# Altium project syspcb.PrjPCB
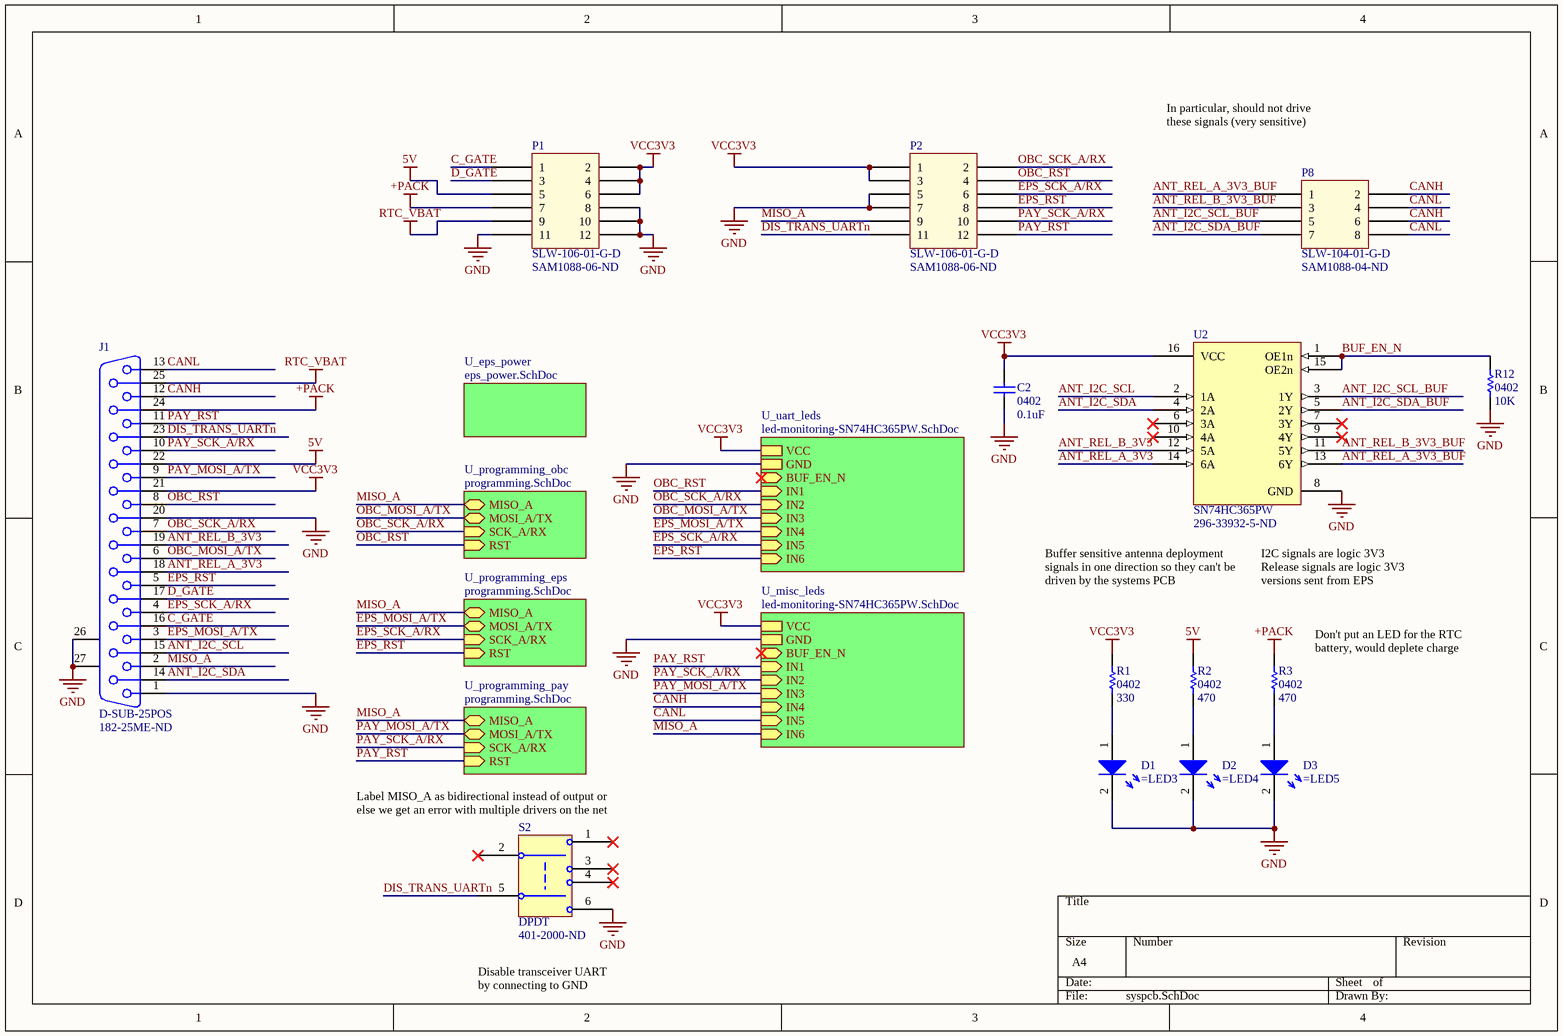
[diagram p0: syspcb.SchDoc]
3 sheets, 37 parts. Net scope: hierarchical (ports join the sheet entries above them; power ports are global).
Board file: syspcb.PcbDoc
Sheets:
  syspcb.SchDoc
    U_eps_power = eps_power.SchDoc
    U_programming_obc = programming.SchDoc
    U_programming_eps = programming.SchDoc
    U_programming_pay = programming.SchDoc

## Sheet syspcb.SchDoc
size A4

### Parts
C2  0402  value 0.1uF  [CAP0402R]
D1  (no value)  [LED0603]
D2  (no value)  [LED0603]
D3  (no value)  [LED0603]
J1  D-SUB-25POS  Supplier Part Number 1: 182-25ME-ND  [D-SUB-25POS]
P1  SLW-106-01-G-D  Supplier Part Number 1: SAM1088-06-ND  [SLW-106-01-X-D]
P2  SLW-106-01-G-D  Supplier Part Number 1: SAM1088-06-ND  [SLW-106-01-X-D]
P8  SLW-104-01-G-D  Supplier Part Number 1: SAM1088-04-ND  [SLW-104-01-X-D]
R1  0402  value 330  [RES0402R]
R2  0402  value 470  [RES0402R]
R3  0402  value 470  [RES0402R]
R12  0402  value 10K  [RES0402R]
S2  DPDT  Supplier Part Number 1: 401-2000-ND  [JS202011AQN - Slide Switch]
U2  SN74HC365PW  Supplier Part Number 1: 296-33932-5-ND  [SOP65P640X120-16N]

### Sub-sheets
U_eps_power = eps_power.SchDoc: no entries
U_misc_leds = led-monitoring-SN74HC365PW.SchDoc (file not in this document): VCC, GND, BUF_EN_N (in), IN1 (in), IN2 (in), IN3 (in), IN4 (in), IN5 (in), IN6 (in)
U_programming_eps = programming.SchDoc: MISO_A (bidir), MOSI_A/TX (bidir), SCK_A/RX (in), RST (in)
U_programming_obc = programming.SchDoc: MISO_A (bidir), MOSI_A/TX (bidir), SCK_A/RX (in), RST (in)
U_programming_pay = programming.SchDoc: MISO_A (bidir), MOSI_A/TX (bidir), SCK_A/RX (in), RST (in)
U_uart_leds = led-monitoring-SN74HC365PW.SchDoc (file not in this document): VCC, GND, BUF_EN_N (in), IN1 (in), IN2 (in), IN3 (in), IN4 (in), IN5 (in), IN6 (in)

### Nets
5V: J1.22 P1.5 R2.2
+PACK: J1.24 P1.7 R3.2
GND: C2.1 D1.2 D2.2 D3.2 J1.1 J1.20 J1.26(MH1) J1.27(MH2) P1.8 P1.10 P1.11 P1.12 P2.5 P2.7 R12.1 S2.6(POLE2B) U2.8(GND) ; sheet U_uart_leds/GND, sheet U_misc_leds/GND
RTC_VBAT: J1.25 P1.9
VCC3V3: C2.2 J1.21 P1.2 P1.4 P1.6 P2.1 P2.3 R1.2 U2.16(VCC) ; sheet U_uart_leds/VCC, sheet U_misc_leds/VCC
ANT_I2C_SCL: J1.15 U2.2(1A)
ANT_I2C_SCL_BUF: P8.5 U2.3(1Y)
ANT_I2C_SDA: J1.14 U2.4(2A)
ANT_I2C_SDA_BUF: P8.7 U2.5(2Y)
ANT_REL_A_3V3: J1.18 U2.14(6A)
ANT_REL_A_3V3_BUF: P8.1 U2.13(6Y)
ANT_REL_B_3V3: J1.19 U2.12(5A)
ANT_REL_B_3V3_BUF: P8.3 U2.11(5Y)
BUF_EN_N: R12.2 U2.1(OE1n) U2.15(OE2n)
C_GATE: J1.16 P1.1
CANH: J1.12 P8.2 P8.6 ; sheet U_misc_leds/IN4
CANL: J1.13 P8.4 P8.8 ; sheet U_misc_leds/IN5
D_GATE: J1.17 P1.3
DIS_TRANS_UARTn: J1.23 P2.11 S2.5(POLE2)
EPS_MOSI_A/TX: J1.3 ; sheet U_programming_eps/MOSI_A/TX, sheet U_uart_leds/IN4
EPS_RST: J1.5 P2.8 ; sheet U_programming_eps/RST, sheet U_uart_leds/IN6
EPS_SCK_A/RX: J1.4 P2.6 ; sheet U_programming_eps/SCK_A/RX, sheet U_uart_leds/IN5
MISO_A: J1.2 P2.9 ; sheet U_programming_obc/MISO_A, sheet U_programming_eps/MISO_A, sheet U_programming_pay/MISO_A, sheet U_misc_leds/IN6
OBC_MOSI_A/TX: J1.6 ; sheet U_programming_obc/MOSI_A/TX, sheet U_uart_leds/IN3
OBC_RST: J1.8 P2.4 ; sheet U_programming_obc/RST, sheet U_uart_leds/IN1
OBC_SCK_A/RX: J1.7 P2.2 ; sheet U_programming_obc/SCK_A/RX, sheet U_uart_leds/IN2
PAY_MOSI_A/TX: J1.9 ; sheet U_programming_pay/MOSI_A/TX, sheet U_misc_leds/IN3
PAY_RST: J1.11 P2.12 ; sheet U_programming_pay/RST, sheet U_misc_leds/IN1
PAY_SCK_A/RX: J1.10 P2.10 ; sheet U_programming_pay/SCK_A/RX, sheet U_misc_leds/IN2
NetD1_1: D1.1 R1.1
NetD2_1: D2.1 R2.1
NetD3_1: D3.1 R3.1

Not connected (* = marked no-connect by the designer): S2 1(POLE1A)* 2(POLE1)* 3(POLE1B)* 4(POLE2A)*; U2 6(3A)* 7(3Y)* 9(4Y)* 10(4A)*

### Notes on the sheet
- In particular, should not drive these signals (very sensitive)
- Buffer sensitive antenna deployment signals in one direction so they can't be driven by the systems PCB
- I2C signals are logic 3V3
  Release signals are logic 3V3 versions sent from EPS
- (near R3) Don't put an LED for the RTC battery, would deplete charge
- (near S2) Label MISO_A as bidirectional instead of output or else we get an error with multiple drivers on the net
- Disable transceiver UART by connecting to GND

### Library data of the parts
C2 = CAP0402: 0402 capacitor; Manufacturer: Taiyo Yuden; Manufacturer Part Number: EMK105B7104KVHF; Voltage Rating: 16V; Capacitance: 100nF; Tolerance: 10%; Dielectric: X7R; Supplier 1: Digi-Key; Supplier Part Number 1: 587-3807-1-ND; Stock 1: 18196; Pricing 1: 1=0.1, 10=0.057, 100=0.0254, 500=0.01812, 1000=0.01423, 2500=0.01294, 5000=0.0119 (USD); Mount: Surface Mount; Case/Package: 0402; Weight: 2.3E-05oz; Case Code (Metric): 1005; Case Code (Imperial): 0402; Min Operating Temperature: -55°C; Max Operating Temperature: 125°C; Package Quantity: 10000; Packaging: Tape and Reel; Termination: SMD/SMT; Voltage Rating (DC): 16V; Length: 0.039inch; Height: 0.5mm; Width: 0.02inch; Thickness: 0.022inch; Ratings: AEC-Q200; Lead Free: Lead Free; Halogen Free: Halogen Free
D1-D3 = LED0603: Generic 0603 LED. Use ChipLED from Osram for generic ones.
J1 = D-SUB-25POS: CONN D-SUB PLUG 25POS R/A SOLDER; Supplier 1: Digi-Key; ComponentLink1Description: Datasheet; ComponentLink1URL: https://www.norcomp.net/rohspdfs/Connectors/18Y/182/182-yyy-113Ryy1.pdf
P1 P2 = SLW-106-01-G-D: CONN RCPT 12POS 0.1 GOLD PCB; Supplier 1: Digi-Key
P8 = SLW-104-01-G-D: CONN RCPT 8POS 0.1 GOLD PCB; Supplier 1: Digi-Key; ComponentLink1Description: Series Datasheet; ComponentLink1URL: http://suddendocs.samtec.com/prints/slw-1xx-01-x-x-mkt.pdf
R1-R3 = RES0402: 0402 resistor
R12 = RES0402: 0402 resistor; Manufacturer: Panasonic; Manufacturer Part Number: ERJ-2RKF1002X; Resistance: 10kR; Power Rating: 100mW; Tolerance: 1%; Voltage Rating: 50V; Temperature Coefficient: 100ppm/°C; Supplier 1: Digi-Key; Supplier Part Number 1: P10.0KLCT-ND; Stock 1: 14350001; Pricing 1: 1=0.1, 10=0.045, 100=0.0183, 1000=0.00823, 2500=0.00715, 5000=0.0059 (USD); Mount: Surface Mount; Case/Package: 0402; Number of Pins: 2; Case Code (Metric): 1005; Case Code (Imperial): 0402; Contact Plating: Tin; Min Operating Temperature: -55°C; Max Operating Temperature: 155°C; Packaging: Tape and Reel; Package Quantity: 1; Composition: Thick Film; Number of Terminations: 2; Termination: SMD/SMT; Military Standard: Not; Max Power Dissipation: 100mW; Voltage Rating (DC): 50V; Features: Automotive AEC-Q200; Length: 1mm; Height: 0.35mm; Width: 0.02inch; Depth: 0.5mm; Radiation Hardening: No; REACH SVHC: No SVHC; Lead Free: Lead Free; ComponentLink1URL: http://industrial.panasonic.com/www-data/pdf/AOA0000/AOA0000CE2.pdf?src-supplier=Future+Electronics; ComponentLink1Description: http://industrial.panasonic.com/www-data/pdf/AOA0000/AOA0000CE2.pdf?src-supplier=Future+Electronics; ComponentLink2URL: http://industrial.panasonic.com/www-data/pdf/AOA0000/AOA0000CE2.pdf?src-supplier=Avnet+Europe; ComponentLink2Description: http://industrial.panasonic.com/www-data/pdf/AOA0000/AOA0000CE2.pdf?src-supplier=Avnet+Europe; ComponentLink3URL: https://industrial.panasonic.com/cdbs/www-data/pdf/RDA0000/DMA0000COL11.pdf?src-supplier=Mouser; ComponentLink3Description: https://industrial.panasonic.com/cdbs/www-data/pdf/RDA0000/DMA0000COL11.pdf?src-supplier=Mouser; ComponentLink4URL: http://www.farnell.com/datasheets/1678782.pdf?src-supplier=Element14; ComponentLink4Description: http://www.farnell.com/datasheets/1678782.pdf?src-supplier=Element14; ComponentLink5URL: http://www.farnell.com/datasheets/1911175.pdf?src-supplier=Farnell; ComponentLink5Description: http://www.farnell.com/datasheets/1911175.pdf?src-supplier=Farnell; ComponentLink6URL: http://www.jameco.com/Jameco/Products/ProdDS/1987020.pdf?src-supplier=Jameco; ComponentLink6Description: http://www.jameco.com/Jameco/Products/ProdDS/1987020.pdf?src-supplier=Jameco; ComponentLink7URL: http://industrial.panasonic.com/www-data/pdf/AOA0000/AOA0000CE2.pdf?src-supplier=Avnet; ComponentLink7Description: http://industrial.panasonic.com/www-data/pdf/AOA0000/AOA0000CE2.pdf?src-supplier=Avnet; ComponentLink8URL: http://www.alliedelec.com/m/d/623f45ff1957d936ff56d46fd1c28cac.pdf?src-supplier=Allied+Electronics; ComponentLink8Description: http://www.alliedelec.com/m/d/623f45ff1957d936ff56d46fd1c28cac.pdf?src-supplier=Allied+Electronics
S2 = DPDT Switch: DPDT Switch, customized for the pinout of the JS202011AQN switch.; Supplier 1: Digi-Key
U2 = SN74HC365PW: Hex non-inverting buffer with 3-state outputs; Supplier 1: Digi-Key

## Sheet eps_power.SchDoc
size A4
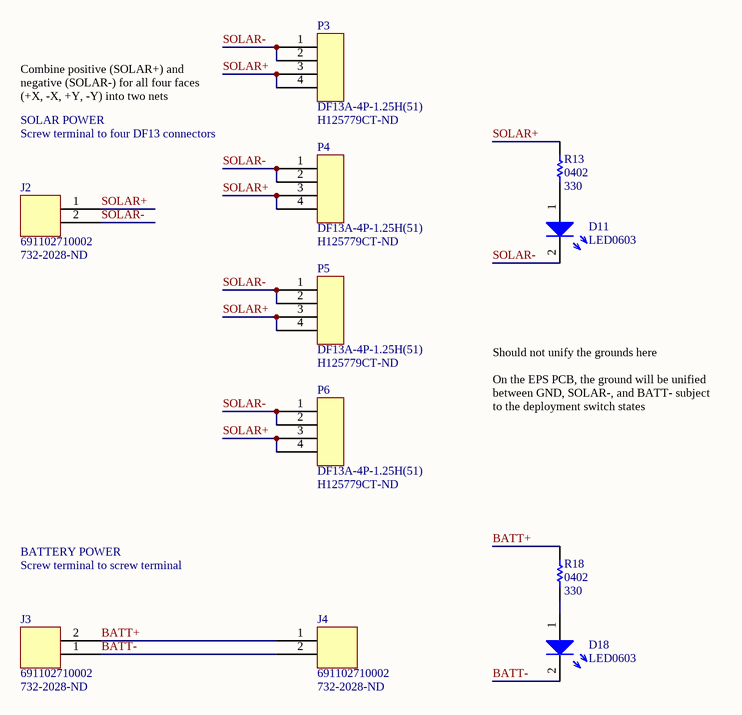
[diagram p1: eps_power.SchDoc]

### Parts
D11  LED0603  [LED0603]
D18  LED0603  [LED0603]
J2  691102710002  Supplier Part Number 1: 732-2028-ND  [CON2_SCREW_5.00MM_691102710002]
J3  691102710002  Supplier Part Number 1: 732-2028-ND  [CON2_SCREW_5.00MM_691102710002]
J4  691102710002  Supplier Part Number 1: 732-2028-ND  [CON2_SCREW_5.00MM_691102710002]
P3  DF13A-4P-1.25H(51)  Supplier Part Number 1: H125779CT-ND  [DF13A-4P-1.25H(51)]
P4  DF13A-4P-1.25H(51)  Supplier Part Number 1: H125779CT-ND  [DF13A-4P-1.25H(51)]
P5  DF13A-4P-1.25H(51)  Supplier Part Number 1: H125779CT-ND  [DF13A-4P-1.25H(51)]
P6  DF13A-4P-1.25H(51)  Supplier Part Number 1: H125779CT-ND  [DF13A-4P-1.25H(51)]
R13  0402  value 330  [RES0402R]
R18  0402  value 330  [RES0402R]

### Nets
BATT+: J3.2 J4.1 R18.2
BATT-: D18.2 J3.1 J4.2
SOLAR+: J2.1 P3.3 P3.4 P4.3 P4.4 P5.3 P5.4 P6.3 P6.4 R13.1
SOLAR-: D11.2 J2.2 P3.1 P3.2 P4.1 P4.2 P5.1 P5.2 P6.1 P6.2
NetD11_1: D11.1 R13.2
NetD18_1: D18.1 R18.1

### Notes on the sheet
- Combine positive (SOLAR+) and negative (SOLAR-) for all four faces (+X, -X, +Y, -Y) into two nets
- SOLAR POWER
- Screw terminal to four DF13 connectors
- Should not unify the grounds here
- On the EPS PCB, the ground will be unified between GND, SOLAR-, and BATT- subject to the deployment switch states
- BATTERY POWER
- Screw terminal to screw terminal

### Library data of the parts
D11 D18 = LED0603: as D1 on sheet syspcb
J2-J4 = 691102710002: 2-POS screw terminal, 5mm pitch; Supplier 1: Digi-Key
P3-P6 = DF13A-4P-1.25H(51): 4 pos DF13 right angle surface mount connector; Supplier 1: Digi-Key
R13 R18 = RES0402: 0402 resistor

## Sheet programming.SchDoc
size A4
Used 3 times, as channels U_programming_obc, U_programming_eps, U_programming_pay. Parts and nets are listed once, with the designators drawn on the sheet.
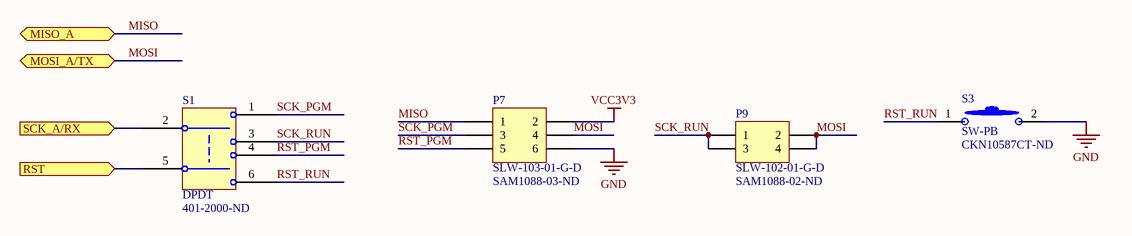
[diagram p2: programming.SchDoc]

### Parts
P7  SLW-103-01-G-D  Supplier Part Number 1: SAM1088-03-ND  [SLW-103-01-X-D]
P9  SLW-102-01-G-D  Supplier Part Number 1: SAM1088-02-ND  [SLW-102-01-X-D]
S1  DPDT  Supplier Part Number 1: 401-2000-ND  [JS202011AQN - Slide Switch]
S3  SW-PB  Supplier Part Number 1: CKN10587CT-ND  [PTS830GM140 SMTR LFS - Pushbutton]

### Ports
MISO_A (bidir), MOSI_A/TX (bidir), RST (in), SCK_A/RX (in)

### Nets
GND: P7.6 S3.2
VCC3V3: P7.2
MISO: P7.1 ; port MISO_A
MOSI: P7.4 P9.2 P9.4 ; port MOSI_A/TX
RST: S1.5(POLE2) ; port RST
RST_PGM: P7.5 S1.4(POLE2A)
RST_RUN: S1.6(POLE2B) S3.1
SCK_A/RX: S1.2(POLE1) ; port SCK_A/RX
SCK_PGM: P7.3 S1.1(POLE1A)
SCK_RUN: P9.1 P9.3 S1.3(POLE1B)

### Channels
U_programming_obc: designators end in _U_programming_obc; ports MISO_A=MISO_A MOSI_A/TX=OBC_MOSI_A/TX RST=OBC_RST SCK_A/RX=OBC_SCK_A/RX
U_programming_eps: designators end in _U_programming_eps; ports MISO_A=MISO_A MOSI_A/TX=EPS_MOSI_A/TX RST=EPS_RST SCK_A/RX=EPS_SCK_A/RX
U_programming_pay: designators end in _U_programming_pay; ports MISO_A=MISO_A MOSI_A/TX=PAY_MOSI_A/TX RST=PAY_RST SCK_A/RX=PAY_SCK_A/RX

### Library data of the parts
P7 = SLW-103-01-G-D: 6 pos 100mil pitch low profile header; Supplier 1: Digi-Key
P9 = SLW-102-01-G-D: 4 pos 100mil pitch low profile header; Supplier 1: Digi-Key
S1 = DPDT Switch: as S2 on sheet syspcb; Supplier 1: Digi-Key
S3 = Pushbutton - Low Profile: Schematic symbol for a generic 2-pin pushbutton, OFF-mom.; Supplier 1: Digi-Key

## Nets that join several sheets
GND: syspcb (17 pins), U_programming_obc (P7_U_programming_obc.6 S3_U_programming_obc.2), U_programming_eps (P7_U_programming_eps.6 S3_U_programming_eps.2), U_programming_pay (P7_U_programming_pay.6 S3_U_programming_pay.2)
VCC3V3: syspcb (9 pins), U_programming_obc (P7_U_programming_obc.2), U_programming_eps (P7_U_programming_eps.2), U_programming_pay (P7_U_programming_pay.2)
EPS_MOSI_A/TX: syspcb (J1.3), U_programming_eps (P7_U_programming_eps.4 P9_U_programming_eps.2 P9_U_programming_eps.4)
EPS_RST: syspcb (J1.5 P2.8), U_programming_eps (S1_U_programming_eps.5)
EPS_SCK_A/RX: syspcb (J1.4 P2.6), U_programming_eps (S1_U_programming_eps.2)
MISO_A: syspcb (J1.2 P2.9), U_programming_obc (P7_U_programming_obc.1), U_programming_eps (P7_U_programming_eps.1), U_programming_pay (P7_U_programming_pay.1)
OBC_MOSI_A/TX: syspcb (J1.6), U_programming_obc (P7_U_programming_obc.4 P9_U_programming_obc.2 P9_U_programming_obc.4)
OBC_RST: syspcb (J1.8 P2.4), U_programming_obc (S1_U_programming_obc.5)
OBC_SCK_A/RX: syspcb (J1.7 P2.2), U_programming_obc (S1_U_programming_obc.2)
PAY_MOSI_A/TX: syspcb (J1.9), U_programming_pay (P7_U_programming_pay.4 P9_U_programming_pay.2 P9_U_programming_pay.4)
PAY_RST: syspcb (J1.11 P2.12), U_programming_pay (S1_U_programming_pay.5)
PAY_SCK_A/RX: syspcb (J1.10 P2.10), U_programming_pay (S1_U_programming_pay.2)